# EAGLE schematic ma8x8_multiplexer (EAGLE 6.6.0)
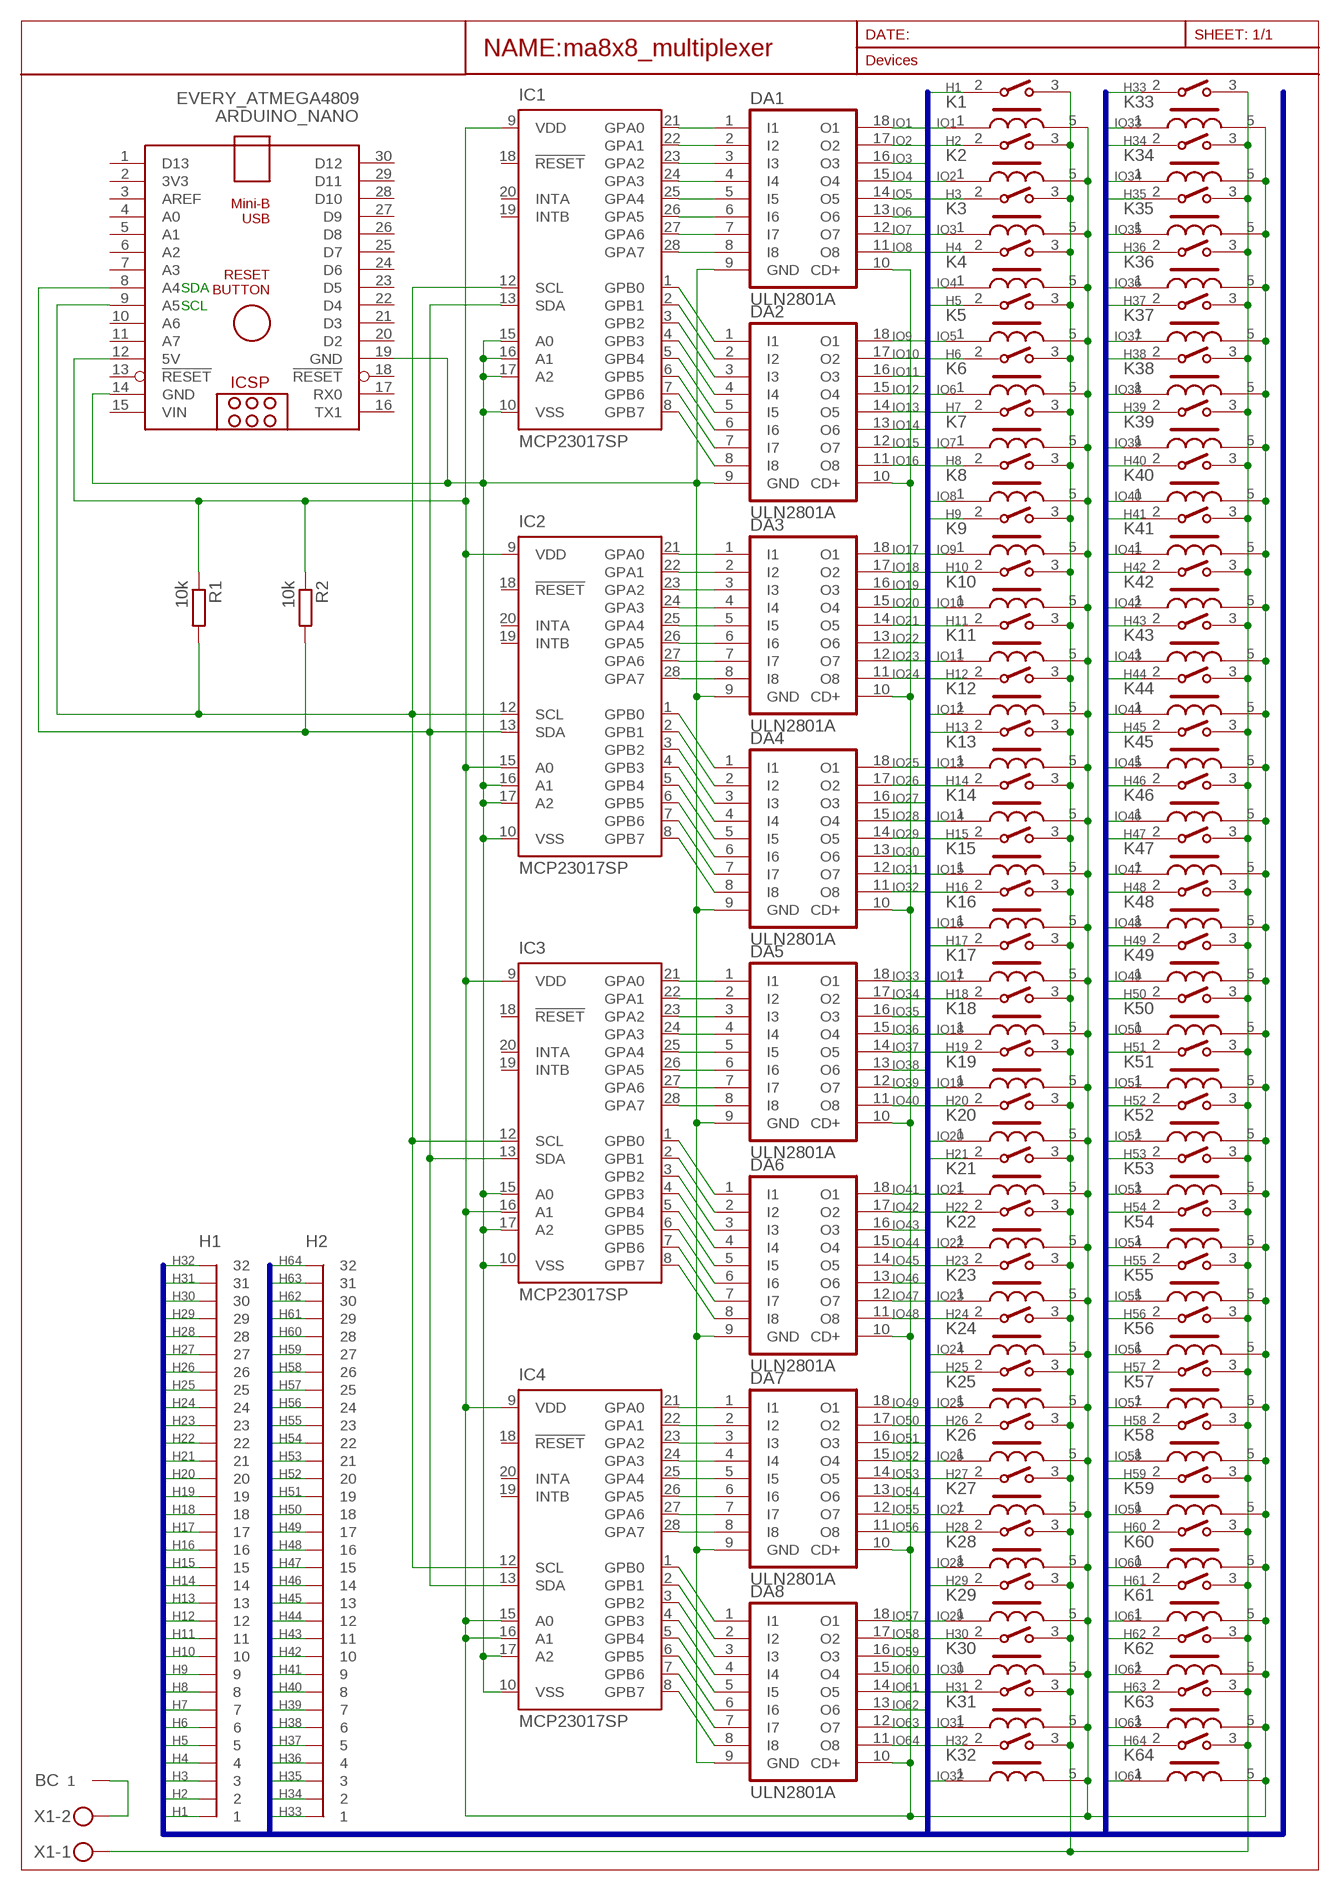
[diagram p0: schematic, sheet 1]

## Parts
ARDUINO_NANO  EVERY_ATMEGA4809  ARDUINO_NANO  [ARDUINO_NANO]
BC  310-47-101-41-001000  [310-47-101-41-001000]
DA1  ULN2801A  [DIL18]
DA2  ULN2801A  [DIL18]
DA3  ULN2801A  [DIL18]
DA4  ULN2801A  [DIL18]
DA5  ULN2801A  [DIL18]
DA6  ULN2801A  [DIL18]
DA7  ULN2801A  [DIL18]
DA8  ULN2801A  [DIL18]
H1  310-47-132-41-001000  [310-47-132-41-001000]
H2  310-47-132-41-001000  [310-47-132-41-001000]
IC1  MCP23017SP  [DIL28-3]
IC2  MCP23017SP  [DIL28-3]
IC3  MCP23017SP  [DIL28-3]
IC4  MCP23017SP  [DIL28-3]
K1  OMRON_G5Q-1A4-EU_DC5  [OMRON_G5Q-1A4-EU_DC5_0]
K2  OMRON_G5Q-1A4-EU_DC5  [OMRON_G5Q-1A4-EU_DC5_0]
K3  OMRON_G5Q-1A4-EU_DC5  [OMRON_G5Q-1A4-EU_DC5_0]
K4  OMRON_G5Q-1A4-EU_DC5  [OMRON_G5Q-1A4-EU_DC5_0]
K5  OMRON_G5Q-1A4-EU_DC5  [OMRON_G5Q-1A4-EU_DC5_0]
K6  OMRON_G5Q-1A4-EU_DC5  [OMRON_G5Q-1A4-EU_DC5_0]
K7  OMRON_G5Q-1A4-EU_DC5  [OMRON_G5Q-1A4-EU_DC5_0]
K8  OMRON_G5Q-1A4-EU_DC5  [OMRON_G5Q-1A4-EU_DC5_0]
K9  OMRON_G5Q-1A4-EU_DC5  [OMRON_G5Q-1A4-EU_DC5_0]
K10  OMRON_G5Q-1A4-EU_DC5  [OMRON_G5Q-1A4-EU_DC5_0]
K11  OMRON_G5Q-1A4-EU_DC5  [OMRON_G5Q-1A4-EU_DC5_0]
K12  OMRON_G5Q-1A4-EU_DC5  [OMRON_G5Q-1A4-EU_DC5_0]
K13  OMRON_G5Q-1A4-EU_DC5  [OMRON_G5Q-1A4-EU_DC5_0]
K14  OMRON_G5Q-1A4-EU_DC5  [OMRON_G5Q-1A4-EU_DC5_0]
K15  OMRON_G5Q-1A4-EU_DC5  [OMRON_G5Q-1A4-EU_DC5_0]
K16  OMRON_G5Q-1A4-EU_DC5  [OMRON_G5Q-1A4-EU_DC5_0]
K17  OMRON_G5Q-1A4-EU_DC5  [OMRON_G5Q-1A4-EU_DC5_0]
K18  OMRON_G5Q-1A4-EU_DC5  [OMRON_G5Q-1A4-EU_DC5_0]
K19  OMRON_G5Q-1A4-EU_DC5  [OMRON_G5Q-1A4-EU_DC5_0]
K20  OMRON_G5Q-1A4-EU_DC5  [OMRON_G5Q-1A4-EU_DC5_0]
K21  OMRON_G5Q-1A4-EU_DC5  [OMRON_G5Q-1A4-EU_DC5_0]
K22  OMRON_G5Q-1A4-EU_DC5  [OMRON_G5Q-1A4-EU_DC5_0]
K23  OMRON_G5Q-1A4-EU_DC5  [OMRON_G5Q-1A4-EU_DC5_0]
K24  OMRON_G5Q-1A4-EU_DC5  [OMRON_G5Q-1A4-EU_DC5_0]
K25  OMRON_G5Q-1A4-EU_DC5  [OMRON_G5Q-1A4-EU_DC5_0]
K26  OMRON_G5Q-1A4-EU_DC5  [OMRON_G5Q-1A4-EU_DC5_0]
K27  OMRON_G5Q-1A4-EU_DC5  [OMRON_G5Q-1A4-EU_DC5_0]
K28  OMRON_G5Q-1A4-EU_DC5  [OMRON_G5Q-1A4-EU_DC5_0]
K29  OMRON_G5Q-1A4-EU_DC5  [OMRON_G5Q-1A4-EU_DC5_0]
K30  OMRON_G5Q-1A4-EU_DC5  [OMRON_G5Q-1A4-EU_DC5_0]
K31  OMRON_G5Q-1A4-EU_DC5  [OMRON_G5Q-1A4-EU_DC5_0]
K32  OMRON_G5Q-1A4-EU_DC5  [OMRON_G5Q-1A4-EU_DC5_0]
K33  OMRON_G5Q-1A4-EU_DC5  [OMRON_G5Q-1A4-EU_DC5_0]
K34  OMRON_G5Q-1A4-EU_DC5  [OMRON_G5Q-1A4-EU_DC5_0]
K35  OMRON_G5Q-1A4-EU_DC5  [OMRON_G5Q-1A4-EU_DC5_0]
K36  OMRON_G5Q-1A4-EU_DC5  [OMRON_G5Q-1A4-EU_DC5_0]
K37  OMRON_G5Q-1A4-EU_DC5  [OMRON_G5Q-1A4-EU_DC5_0]
K38  OMRON_G5Q-1A4-EU_DC5  [OMRON_G5Q-1A4-EU_DC5_0]
K39  OMRON_G5Q-1A4-EU_DC5  [OMRON_G5Q-1A4-EU_DC5_0]
K40  OMRON_G5Q-1A4-EU_DC5  [OMRON_G5Q-1A4-EU_DC5_0]
K41  OMRON_G5Q-1A4-EU_DC5  [OMRON_G5Q-1A4-EU_DC5_0]
K42  OMRON_G5Q-1A4-EU_DC5  [OMRON_G5Q-1A4-EU_DC5_0]
K43  OMRON_G5Q-1A4-EU_DC5  [OMRON_G5Q-1A4-EU_DC5_0]
K44  OMRON_G5Q-1A4-EU_DC5  [OMRON_G5Q-1A4-EU_DC5_0]
K45  OMRON_G5Q-1A4-EU_DC5  [OMRON_G5Q-1A4-EU_DC5_0]
K46  OMRON_G5Q-1A4-EU_DC5  [OMRON_G5Q-1A4-EU_DC5_0]
K47  OMRON_G5Q-1A4-EU_DC5  [OMRON_G5Q-1A4-EU_DC5_0]
K48  OMRON_G5Q-1A4-EU_DC5  [OMRON_G5Q-1A4-EU_DC5_0]
K49  OMRON_G5Q-1A4-EU_DC5  [OMRON_G5Q-1A4-EU_DC5_0]
K50  OMRON_G5Q-1A4-EU_DC5  [OMRON_G5Q-1A4-EU_DC5_0]
K51  OMRON_G5Q-1A4-EU_DC5  [OMRON_G5Q-1A4-EU_DC5_0]
K52  OMRON_G5Q-1A4-EU_DC5  [OMRON_G5Q-1A4-EU_DC5_0]
K53  OMRON_G5Q-1A4-EU_DC5  [OMRON_G5Q-1A4-EU_DC5_0]
K54  OMRON_G5Q-1A4-EU_DC5  [OMRON_G5Q-1A4-EU_DC5_0]
K55  OMRON_G5Q-1A4-EU_DC5  [OMRON_G5Q-1A4-EU_DC5_0]
K56  OMRON_G5Q-1A4-EU_DC5  [OMRON_G5Q-1A4-EU_DC5_0]
K57  OMRON_G5Q-1A4-EU_DC5  [OMRON_G5Q-1A4-EU_DC5_0]
K58  OMRON_G5Q-1A4-EU_DC5  [OMRON_G5Q-1A4-EU_DC5_0]
K59  OMRON_G5Q-1A4-EU_DC5  [OMRON_G5Q-1A4-EU_DC5_0]
K60  OMRON_G5Q-1A4-EU_DC5  [OMRON_G5Q-1A4-EU_DC5_0]
K61  OMRON_G5Q-1A4-EU_DC5  [OMRON_G5Q-1A4-EU_DC5_0]
K62  OMRON_G5Q-1A4-EU_DC5  [OMRON_G5Q-1A4-EU_DC5_0]
K63  OMRON_G5Q-1A4-EU_DC5  [OMRON_G5Q-1A4-EU_DC5_0]
K64  OMRON_G5Q-1A4-EU_DC5  [OMRON_G5Q-1A4-EU_DC5_0]
R1  10k  R-EU_R1206  [R1206]
R2  10k  R-EU_R1206  [R1206]
X1  MKDSN1,5/2-5,08  [MKDSN1,5/2-5,08]

## Nets
5V: ARDUINO_NANO.12(5V) DA1.10(CD+) DA2.10(CD+) DA3.10(CD+) DA4.10(CD+) DA5.10(CD+) DA6.10(CD+) DA7.10(CD+) DA8.10(CD+) IC1.9(VDD) IC2.9(VDD) IC2.15(A0) IC3.9(VDD) IC3.16(A1) IC4.9(VDD) IC4.15(A0) IC4.16(A1) K1.5 K2.5 K3.5 K4.5 K5.5 K6.5 K7.5 K8.5 K9.5 K10.5 K11.5 K12.5 K13.5 K14.5 K15.5 K16.5 K17.5 K18.5 K19.5 K20.5 K21.5 K22.5 K23.5 K24.5 K25.5 K26.5 K27.5 K28.5 K29.5 K30.5 K31.5 K32.5 K33.5 K34.5 K35.5 K36.5 K37.5 K38.5 K39.5 K40.5 K41.5 K42.5 K43.5 K44.5 K45.5 K46.5 K47.5 K48.5 K49.5 K50.5 K51.5 K52.5 K53.5 K54.5 K55.5 K56.5 K57.5 K58.5 K59.5 K60.5 K61.5 K62.5 K63.5 K64.5 R1.1 R2.1
BC: BC.1 X1.2
FC: K1.3 K2.3 K3.3 K4.3 K5.3 K6.3 K7.3 K8.3 K9.3 K10.3 K11.3 K12.3 K13.3 K14.3 K15.3 K16.3 K17.3 K18.3 K19.3 K20.3 K21.3 K22.3 K23.3 K24.3 K25.3 K26.3 K27.3 K28.3 K29.3 K30.3 K31.3 K32.3 K33.3 K34.3 K35.3 K36.3 K37.3 K38.3 K39.3 K40.3 K41.3 K42.3 K43.3 K44.3 K45.3 K46.3 K47.3 K48.3 K49.3 K50.3 K51.3 K52.3 K53.3 K54.3 K55.3 K56.3 K57.3 K58.3 K59.3 K60.3 K61.3 K62.3 K63.3 K64.3 X1.1
GND: ARDUINO_NANO.14(GND) ARDUINO_NANO.19(GND) DA1.9(GND) DA2.9(GND) DA3.9(GND) DA4.9(GND) DA5.9(GND) DA6.9(GND) DA7.9(GND) DA8.9(GND) IC1.10(VSS) IC1.15(A0) IC1.16(A1) IC1.17(A2) IC2.10(VSS) IC2.16(A1) IC2.17(A2) IC3.10(VSS) IC3.15(A0) IC3.17(A2) IC4.10(VSS) IC4.17(A2)
H1: H1.1 K1.2
H2: H1.2 K2.2
H3: H1.3 K3.2
H4: H1.4 K4.2
H5: H1.5 K5.2
H6: H1.6 K6.2
H7: H1.7 K7.2
H8: H1.8 K8.2
H9: H1.9 K9.2
H10: H1.10 K10.2
H11: H1.11 K11.2
H12: H1.12 K12.2
H13: H1.13 K13.2
H14: H1.14 K14.2
H15: H1.15 K15.2
H16: H1.16 K16.2
H17: H1.17 K17.2
H18: H1.18 K18.2
H19: H1.19 K19.2
H20: H1.20 K20.2
H21: H1.21 K21.2
H22: H1.22 K22.2
H23: H1.23 K23.2
H24: H1.24 K24.2
H25: H1.25 K25.2
H26: H1.26 K26.2
H27: H1.27 K27.2
H28: H1.28 K28.2
H29: H1.29 K29.2
H30: H1.30 K30.2
H31: H1.31 K31.2
H32: H1.32 K32.2
H33: H2.1 K33.2
H34: H2.2 K34.2
H35: H2.3 K35.2
H36: H2.4 K36.2
H37: H2.5 K37.2
H38: H2.6 K38.2
H39: H2.7 K39.2
H40: H2.8 K40.2
H41: H2.9 K41.2
H42: H2.10 K42.2
H43: H2.11 K43.2
H44: H2.12 K44.2
H45: H2.13 K45.2
H46: H2.14 K46.2
H47: H2.15 K47.2
H48: H2.16 K48.2
H49: H2.17 K49.2
H50: H2.18 K50.2
H51: H2.19 K51.2
H52: H2.20 K52.2
H53: H2.21 K53.2
H54: H2.22 K54.2
H55: H2.23 K55.2
H56: H2.24 K56.2
H57: H2.25 K57.2
H58: H2.26 K58.2
H59: H2.27 K59.2
H60: H2.28 K60.2
H61: H2.29 K61.2
H62: H2.30 K62.2
H63: H2.31 K63.2
H64: H2.32 K64.2
IO1: DA1.18(O1) K1.1
IO2: DA1.17(O2) K2.1
IO3: DA1.16(O3) K3.1
IO4: DA1.15(O4) K4.1
IO5: DA1.14(O5) K5.1
IO6: DA1.13(O6) K6.1
IO7: DA1.12(O7) K7.1
IO8: DA1.11(O8) K8.1
IO9: DA2.18(O1) K9.1
IO10: DA2.17(O2) K10.1
IO11: DA2.16(O3) K11.1
IO12: DA2.15(O4) K12.1
IO13: DA2.14(O5) K13.1
IO14: DA2.13(O6) K14.1
IO15: DA2.12(O7) K15.1
IO16: DA2.11(O8) K16.1
IO17: DA3.18(O1) K17.1
IO18: DA3.17(O2) K18.1
IO19: DA3.16(O3) K19.1
IO20: DA3.15(O4) K20.1
IO21: DA3.14(O5) K21.1
IO22: DA3.13(O6) K22.1
IO23: DA3.12(O7) K23.1
IO24: DA3.11(O8) K24.1
IO25: DA4.18(O1) K25.1
IO26: DA4.17(O2) K26.1
IO27: DA4.16(O3) K27.1
IO28: DA4.15(O4) K28.1
IO29: DA4.14(O5) K29.1
IO30: DA4.13(O6) K30.1
IO31: DA4.12(O7) K31.1
IO32: DA4.11(O8) K32.1
IO33: DA5.18(O1) K33.1
IO34: DA5.17(O2) K34.1
IO35: DA5.16(O3) K35.1
IO36: DA5.15(O4) K36.1
IO37: DA5.14(O5) K37.1
IO38: DA5.13(O6) K38.1
IO39: DA5.12(O7) K39.1
IO40: DA5.11(O8) K40.1
IO41: DA6.18(O1) K41.1
IO42: DA6.17(O2) K42.1
IO43: DA6.16(O3) K43.1
IO44: DA6.15(O4) K44.1
IO45: DA6.14(O5) K45.1
IO46: DA6.13(O6) K46.1
IO47: DA6.12(O7) K47.1
IO48: DA6.11(O8) K48.1
IO49: DA7.18(O1) K49.1
IO50: DA7.17(O2) K50.1
IO51: DA7.16(O3) K51.1
IO52: DA7.15(O4) K52.1
IO53: DA7.14(O5) K53.1
IO54: DA7.13(O6) K54.1
IO55: DA7.12(O7) K55.1
IO56: DA7.11(O8) K56.1
IO57: DA8.18(O1) K57.1
IO58: DA8.17(O2) K58.1
IO59: DA8.16(O3) K59.1
IO60: DA8.15(O4) K60.1
IO61: DA8.14(O5) K61.1
IO62: DA8.13(O6) K62.1
IO63: DA8.12(O7) K63.1
IO64: DA8.11(O8) K64.1
N$1: DA1.1(I1) IC1.21(GPA0)
N$2: DA1.2(I2) IC1.22(GPA1)
N$3: DA1.3(I3) IC1.23(GPA2)
N$4: DA1.4(I4) IC1.24(GPA3)
N$5: DA1.5(I5) IC1.25(GPA4)
N$6: DA1.6(I6) IC1.26(GPA5)
N$7: DA1.7(I7) IC1.27(GPA6)
N$8: DA1.8(I8) IC1.28(GPA7)
N$9: DA2.1(I1) IC1.1(GPB0)
N$10: DA2.2(I2) IC1.2(GPB1)
N$11: DA2.3(I3) IC1.3(GPB2)
N$12: DA2.4(I4) IC1.4(GPB3)
N$13: DA2.5(I5) IC1.5(GPB4)
N$14: DA2.6(I6) IC1.6(GPB5)
N$15: DA2.7(I7) IC1.7(GPB6)
N$16: DA2.8(I8) IC1.8(GPB7)
N$17: DA3.1(I1) IC2.21(GPA0)
N$18: DA3.2(I2) IC2.22(GPA1)
N$19: DA3.3(I3) IC2.23(GPA2)
N$20: DA3.4(I4) IC2.24(GPA3)
N$21: DA3.5(I5) IC2.25(GPA4)
N$22: DA3.6(I6) IC2.26(GPA5)
N$23: DA3.7(I7) IC2.27(GPA6)
N$24: DA3.8(I8) IC2.28(GPA7)
N$25: DA4.8(I8) IC2.8(GPB7)
N$26: DA4.7(I7) IC2.7(GPB6)
N$27: DA4.6(I6) IC2.6(GPB5)
N$28: DA4.5(I5) IC2.5(GPB4)
N$29: DA4.4(I4) IC2.4(GPB3)
N$30: DA4.3(I3) IC2.3(GPB2)
N$31: DA4.2(I2) IC2.2(GPB1)
N$32: DA4.1(I1) IC2.1(GPB0)
N$33: DA5.1(I1) IC3.21(GPA0)
N$34: DA5.2(I2) IC3.22(GPA1)
N$35: DA5.3(I3) IC3.23(GPA2)
N$36: DA5.4(I4) IC3.24(GPA3)
N$37: DA5.5(I5) IC3.25(GPA4)
N$38: DA5.6(I6) IC3.26(GPA5)
N$39: DA5.7(I7) IC3.27(GPA6)
N$40: DA5.8(I8) IC3.28(GPA7)
N$41: DA6.1(I1) IC3.1(GPB0)
N$42: DA6.2(I2) IC3.2(GPB1)
N$43: DA6.3(I3) IC3.3(GPB2)
N$44: DA6.4(I4) IC3.4(GPB3)
N$45: DA6.5(I5) IC3.5(GPB4)
N$46: DA6.6(I6) IC3.6(GPB5)
N$47: DA6.7(I7) IC3.7(GPB6)
N$48: DA6.8(I8) IC3.8(GPB7)
N$49: DA7.1(I1) IC4.21(GPA0)
N$50: DA7.2(I2) IC4.22(GPA1)
N$51: DA7.3(I3) IC4.23(GPA2)
N$52: DA7.4(I4) IC4.24(GPA3)
N$53: DA7.5(I5) IC4.25(GPA4)
N$54: DA7.6(I6) IC4.26(GPA5)
N$55: DA7.7(I7) IC4.27(GPA6)
N$56: DA7.8(I8) IC4.28(GPA7)
N$57: DA8.1(I1) IC4.1(GPB0)
N$58: DA8.2(I2) IC4.2(GPB1)
N$59: DA8.3(I3) IC4.3(GPB2)
N$60: DA8.4(I4) IC4.4(GPB3)
N$61: DA8.5(I5) IC4.5(GPB4)
N$62: DA8.6(I6) IC4.6(GPB5)
N$63: DA8.7(I7) IC4.7(GPB6)
N$64: DA8.8(I8) IC4.8(GPB7)
SCL: ARDUINO_NANO.9(A5) IC1.12(SCL) IC2.12(SCL) IC3.12(SCL) IC4.12(SCL) R1.2
SDA: ARDUINO_NANO.8(A4) IC1.13(SDA) IC2.13(SDA) IC3.13(SDA) IC4.13(SDA) R2.2
Unconnected: ARDUINO_NANO.1(D13) ARDUINO_NANO.2(3V3) ARDUINO_NANO.3(AREF) ARDUINO_NANO.4(A0) ARDUINO_NANO.5(A1) ARDUINO_NANO.6(A2) ARDUINO_NANO.7(A3) ARDUINO_NANO.10(A6) ARDUINO_NANO.11(A7) ARDUINO_NANO.13(!RESET) ARDUINO_NANO.16(TX1) ARDUINO_NANO.17(RX0) ARDUINO_NANO.18(!RESET) ARDUINO_NANO.20(D2) ARDUINO_NANO.21(D3) ARDUINO_NANO.22(D4) ARDUINO_NANO.23(D5) ARDUINO_NANO.24(D6) ARDUINO_NANO.25(D7) ARDUINO_NANO.26(D8) ARDUINO_NANO.27(D9) ARDUINO_NANO.28(D10) ARDUINO_NANO.29(D11) ARDUINO_NANO.30(D12) IC1.18(!RESET) IC1.19(INTB) IC1.20(INTA) IC2.18(!RESET) IC2.19(INTB) IC2.20(INTA) IC3.18(!RESET) IC3.19(INTB) IC3.20(INTA) IC4.18(!RESET) IC4.19(INTB) IC4.20(INTA)

## Buses
BUS:H[1..64],IO[1..64]

## Notes on the sheet
- SDA
- SCL

## Power pins joined to a net without a drawn wire
VIN: ARDUINO_NANO.15(VIN)

## Library data of the parts
ARDUINO_NANO = ArduinoNanoV30:ARDUINO_NANO: Arduino Nano V3.0 Overview: The Arduino Nano is a small, complete, and breadboard-friendly board based on the ATmega328 (Arduino Nano 3.x) or ATmega168 (Arduino Nano 2.x). It has more or less the same functionality of the Arduino Duemilanove, but in a different package. It lacks only a DC power jack, and works with a Mini-B USB cable instead of a standard one. The Nano was designed and is being produced by Gravitech. Specifications: Microcontroller Atmel ATmega168 or ATmega328 Operating Voltage (logic level) 5 V Input Voltage (recommended) 7-12 V Input Voltage (limits) 6-20 V Digital I/O Pins 14 (of which 6 provide PWM output) Analog Input Pins 8 DC Current per I/O Pin 40 mA Flash Memory 16 KB (ATmega168) or 32 KB (ATmega328) of which 2 KB used by bootloader SRAM 1 KB (ATmega168) or 2 KB (ATmega328) EEPROM 512 bytes (ATmega168) or 1 KB (ATmega328) Clock Speed 16 MHz Dimensions 0.73" x 1.70" Length 45 mm Width 18 mm Weigth 5 g Power: The Arduino Nano can be powered via the Mini-B USB connection, 6-20V unregulated external power supply (pin 30), or 5V regulated external power supply (pin 27). The power source is automatically selected to the highest voltage source. Memory: The ATmega168 has 16 KB of flash memory for storing code (of which 2 KB is used for the bootloader); the ATmega328 has 32 KB, (also with 2 KB used for the bootloader). The ATmega168 has 1 KB of SRAM and 512 bytes of EEPROM (which can be read and written with the EEPROM library); the ATmega328 has 2 KB of SRAM and 1 KB of EEPROM. Input and Output: Each of the 14 digital pins on the Nano can be used as an input or output, using pinMode(), digitalWrite(), and digitalRead() functions. They operate at 5 volts. Each pin can provide or receive a maximum of 40 mA and has an internal pull-up resistor (disconnected by default) of 20-50 kOhms. In addition, some pins have specialized functions. Visit Arduino - ArduinoBoardNano <https://www.arduino.cc/en/Main/ArduinoBoardNano>
BC = con-headers-millmax:310-47-101-41-001000
DA1-DA8 = uln-udn:ULN2801A: DRIVER ARRAY
H1 H2 = con-headers-millmax:310-47-132-41-001000
IC1-IC4 = microchip:MCP23017: http://ww1.microchip.com/downloads/en/DeviceDoc/21952a.pdf Source: http://ww1.microchip.com/downloads/en/DeviceDoc/21952a.pdf; MF: MICROCHIP; MPN: MCP23017-E/SP; OC_FARNELL: 1332088; OC_NEWARK: 31K2959
K1-K64 = Omron - G5Q-1A4-EU DC5:OMRON_G5Q-1A4-EU_DC5: Electromechanical Relay SPST-NO 5(NO)/3(NC)ADC/10(NO)/3(NC)AAC 5VDC 125Ohm Through Hole
R1 R2 = rcl:R-EU_: RESISTOR, European symbol
X1 = con-phoenix-508:MKDSN1,5/2-5,08: MKDSN 1,5/ 2-5,08 Printklemme Nennstrom: 13,5 A Nennspannung: 250 V Rastermaß: 5,08 mm Polzahl: 2 Anschlussart: Schraubanschluss Montage: Löten Anschlussrichtung Leiter/Platine: 0 ° Artikelnummer: 1729128 Source: http://eshop.phoenixcontact.com .. 1729128.pdf